# EAGLE design EvapLITE (EAGLE 9.3.1)
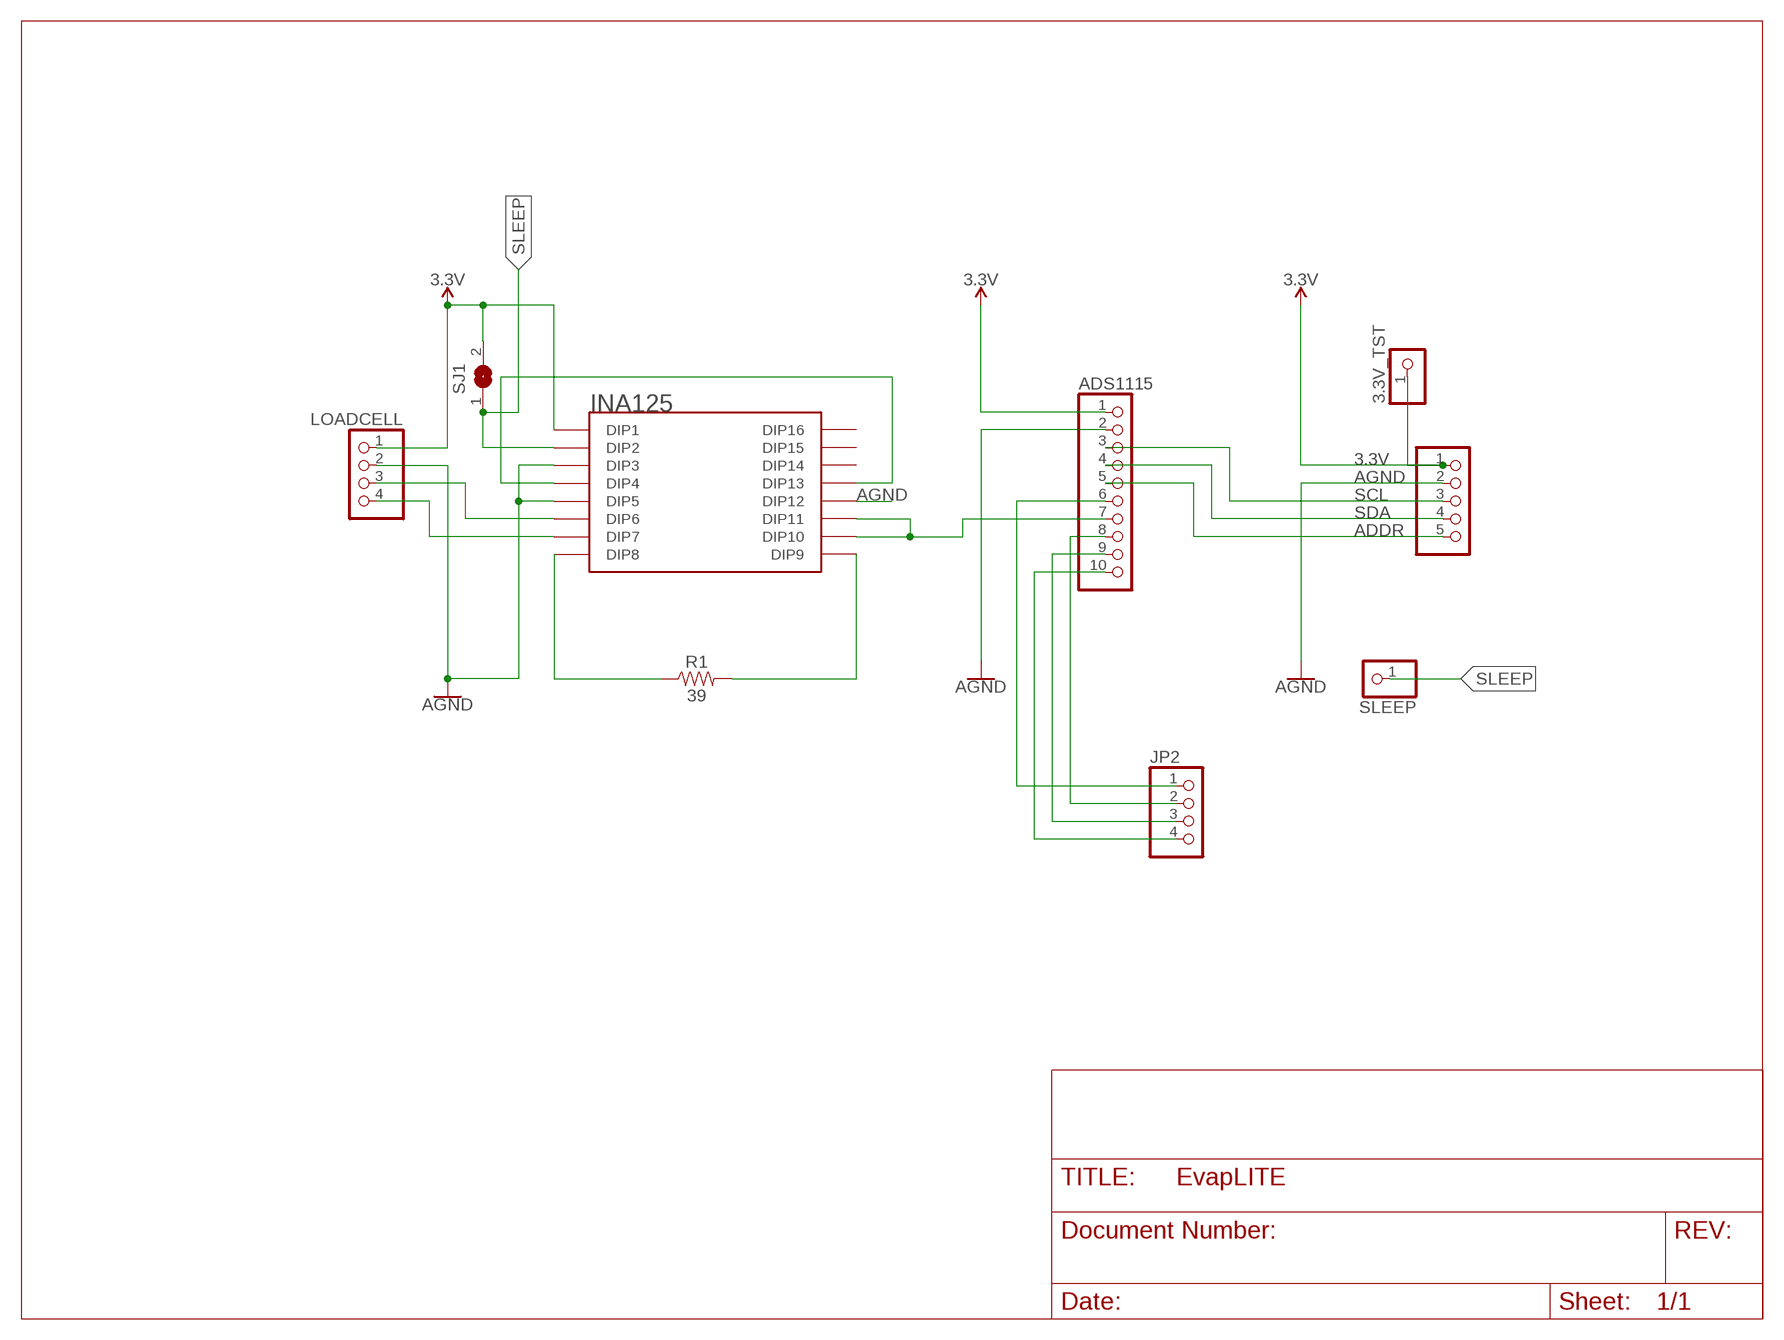
[diagram p0: schematic, sheet 1]

## Parts
3.3V_TST  PINHD-1X1  [1X01]
ADS1115  PINHD-1X10  [1X10]
I2C  PINHD-1X5  [1X05]
INA125  16-PIN_DIP  [16-PIN_DIP]
JP2  PINHD-1X4  [1X04]
LOADCELL  PINHD-1X4  [1X04]
R1  39  RESISTORAXIAL-0.3  [AXIAL-0.3]
SJ1  SJ  [SJ]
SLEEP  PINHD-1X1  [1X01]

## Nets
3.3V: 3.3V_TST.1 ADS1115.1 I2C.1 INA125.DIP1 LOADCELL.1 SJ1.2
ADDR: ADS1115.5 I2C.5
AGND: ADS1115.2 I2C.2 INA125.DIP3 INA125.DIP5 INA125.DIP12 LOADCELL.2
N$1: INA125.DIP4 INA125.DIP13
N$2: INA125.DIP6 LOADCELL.3
N$3: INA125.DIP7 LOADCELL.4
N$4: INA125.DIP8 R1.P$1
N$5: INA125.DIP9 R1.P$2
N$6: ADS1115.7 INA125.DIP10 INA125.DIP11
N$7: ADS1115.8 JP2.2
N$8: ADS1115.9 JP2.3
N$9: ADS1115.10 JP2.4
N$10: ADS1115.6 JP2.1
SCL: ADS1115.3 I2C.3
SDA: ADS1115.4 I2C.4
SLEEP: INA125.DIP2 SJ1.1 SLEEP.1
Unconnected: INA125.DIP14 INA125.DIP15 INA125.DIP16

## Library data of the parts
3.3V_TST SLEEP = pinhead:PINHD-1X1: PIN HEADER
ADS1115 = pinhead:PINHD-1X10: PIN HEADER
I2C = pinhead:PINHD-1X5: PIN HEADER
INA125 = OPEnS_Lab_parts:16-PIN_DIP
JP2 LOADCELL = pinhead:PINHD-1X4: PIN HEADER
R1 = SparkFun-Resistors:RESISTOR: Generic Resistor Package
SJ1 = jumper:SJ: SMD solder JUMPER

## Board
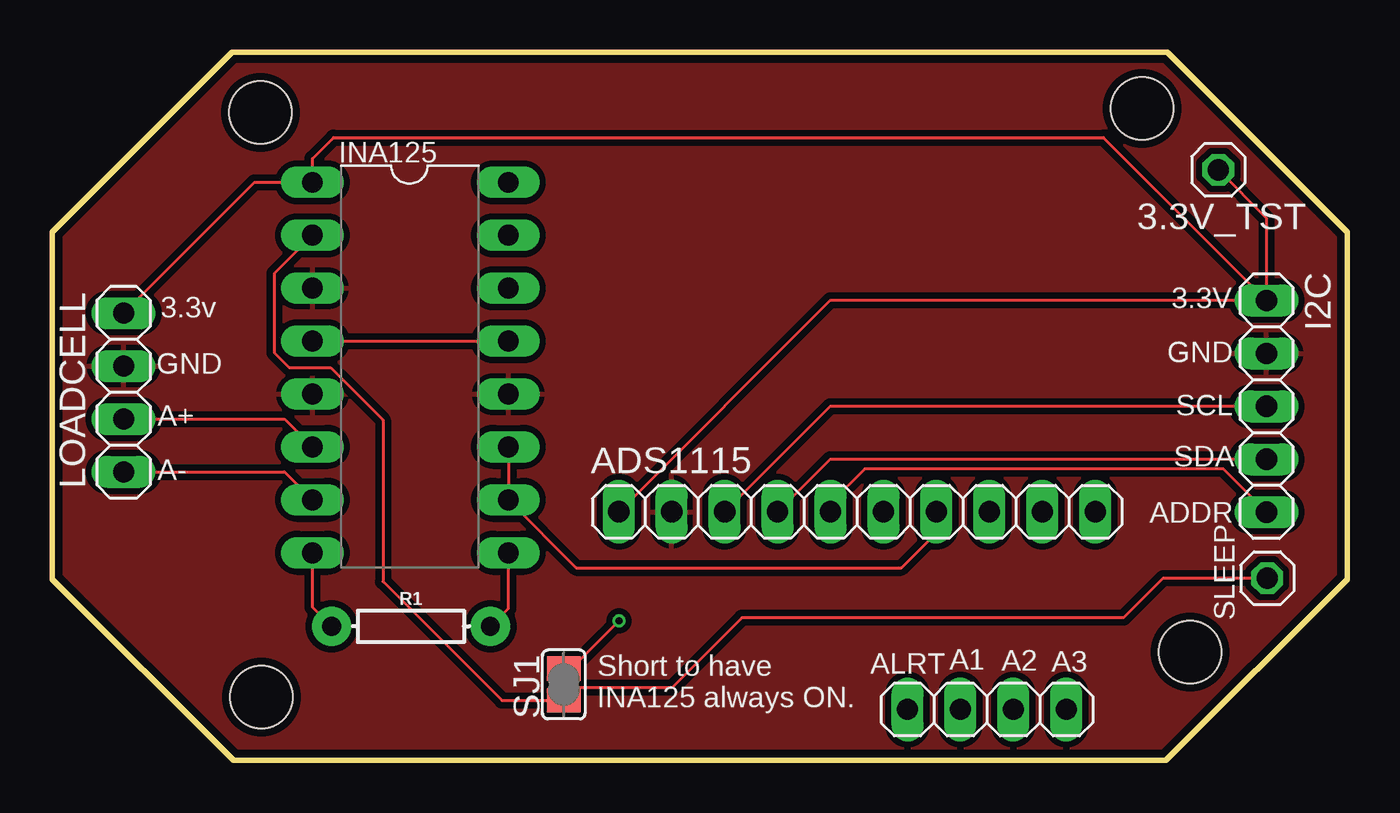
[diagram p1: board, top side]
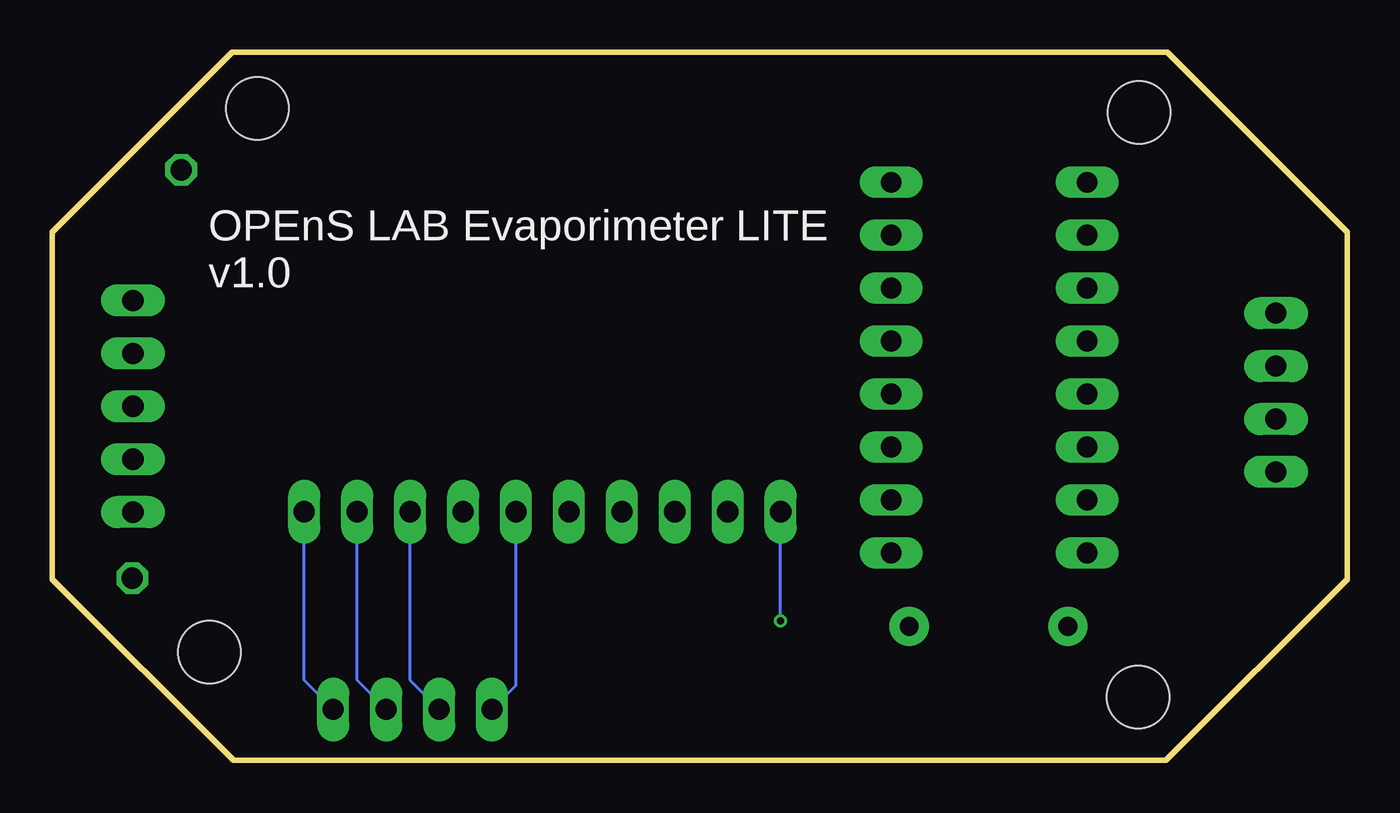
[diagram p2: board, bottom side, seen from below]

Size 62.15 x 34 mm. Coordinates in mm from the lower left corner, seen from the top.
Outline: 53.5,34 62.15,25.35 62.15,8.7 53.45,0 8.7,0 0,8.7 0,25.35 8.65,34 53.5,34
Copper layers (1*16): Top 0.035559375mm / dielectric 1.6mm / Bottom 0.035559375mm
Design rules "oshpark-2layer": minimum track width 6mil, minimum drill 10mil, track to track 6mil, track to pad 6mil, pad to pad 6mil, via to via 6mil, smd to smd 6mil, copper to edge 15mil, drill to drill 6mil, minimum pad ring 5mil, minimum via ring 5mil, stop-mask expansion 2.5mil, vias tented up to drill 0mil, thermal gap 10mil
Holes 3 mm at 10.05,3.05 10,31.1 52.3,31.3 54.6,5.2

### Footprints (pad centres in the part's own frame; a part is rotated, then mirrored left to right if it is on the bottom)
1X01 = drill 1.016 octagon: 1 0,0
1X10 = drill 1.016 long: 1 -11.43,0; 2 -8.89,0; 3 -6.35,0; 4 -3.81,0; 5 -1.27,0; 6 1.27,0; 7 3.81,0; 8 6.35,0; 9 8.89,0; 10 11.43,0
1X05 = drill 1.016 long: 1 -5.08,0; 2 -2.54,0; 3 0,0; 4 2.54,0; 5 5.08,0
16-PIN_DIP = drill 1 long: DIP1 -5.08,8.89; DIP2 -5.08,6.35; DIP3 -5.08,3.81; DIP4 -5.08,1.27; DIP5 -5.08,-1.27; DIP6 -5.08,-3.81; DIP7 -5.08,-6.35; DIP8 -5.08,-8.89; DIP9 4.32,-8.89; DIP10 4.32,-6.35; DIP11 4.32,-3.81; DIP12 4.32,-1.27; DIP13 4.32,1.27; DIP14 4.32,3.81; DIP15 4.32,6.35; DIP16 4.32,8.89
1X04 = drill 1.016 long: 1 -3.81,0; 2 -1.27,0; 3 1.27,0; 4 3.81,0
AXIAL-0.3 = drill 0.9 pad 1.88: P$1 -3.81,0; P$2 3.81,0
SJ = smd 1.168 x 1.6: 1 -0.762,0; 2 0.762,0

### Placement (x,y rotation side)
3.3V_TST  55.95,28.35 0 top
ADS1115  38.62,11.94 0 top
I2C  58.27,17 270 top
INA125  17.57,18.86 0 top
JP2  44.85,2.45 0 top
LOADCELL  3.43,17.66 270 top
R1  17.22,6.44 0 top
SJ1  24.55,3.65 90 top
SLEEP  58.3,8.75 0 top

### Tracks (layer width: path | path; a pad name or v marks a point on that pad's centre or on a via)
3.3V  (via drill 0.35)
  Top 0.152: LOADCELL.1 9.71,27.75 INA125.DIP1 12.49,28.89 13.5,29.9 50.45,29.9 I2C.1 | I2C.1 37.33,22.08 ADS1115.1 | 3.3V_TST.1 58.27,26.03 I2C.1 | v27.2,6.7 24.91,4.41 SJ1.2
  Bottom 0.152: v27.2,6.7 ADS1115.1
ADDR
  Top 0.152: I2C.5 56.19,14 39,14 37.35,12.35 ADS1115.5
AGND
  pour Top (isolate 0.305): 0,25.35 8.65,34 53.5,34 62.15,25.35 62.15,8.7 53.45,0 8.7,0 0,8.7
N$1
  Top 0.152: INA125.DIP4 INA125.DIP13
N$2
  Top 0.152: LOADCELL.3 11.15,16.39 INA125.DIP6
N$3
  Top 0.152: LOADCELL.4 11.15,13.85 INA125.DIP7
N$4
  Top 0.152: R1.P$1 12.49,7.36 INA125.DIP8
N$5
  Top 0.152: R1.P$2 21.89,7.3 INA125.DIP9
N$6
  Top 0.152: INA125.DIP11 INA125.DIP10 25.15,9.25 40.75,9.25 42.43,10.93 ADS1115.7
N$7
  Bottom 0.152: JP2.2 44.97,3.84 ADS1115.8
N$8
  Bottom 0.152: JP2.3 47.51,3.84 ADS1115.9
N$9
  Bottom 0.152: JP2.4 50.05,3.84 ADS1115.10
N$10
  Bottom 0.152: JP2.1 39.89,3.6 ADS1115.6
SCL
  Top 0.152: I2C.3 37.33,17 ADS1115.3
SDA
  Top 0.152: I2C.4 37.33,14.46 ADS1115.4
SLEEP
  Top 0.152: SLEEP.1 53.3,8.75 51.4,6.85 33.1,6.85 29.75,3.5 25.16,3.5 SJ1.1 21.58,2.89 15.87,8.6 15.87,16.34 13.35,18.86 11.38,18.86 10.66,19.57 10.66,23.38 INA125.DIP2

### Text on the board
tPlace: 3.3V | 3.3v | GND | GND | SCL | A+ | SDA | A- | ADDR | ALRT | A1 | A2 | A3 | Short to have / INA125 always ON.
bPlace: OPEnS LAB Evaporimeter LITE / v1.0